# Altium project UHAL_MICRO_SD_BREAKOUT.PrjPcb
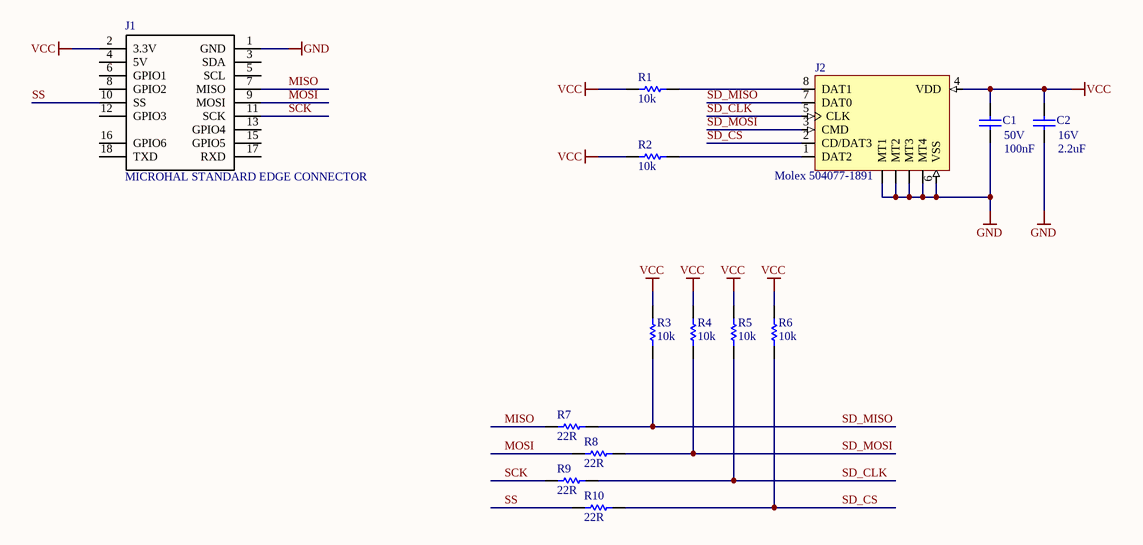
[diagram p0: micro_sd.SchDoc]
1 sheet, 14 parts. Net scope: global (net labels, ports and power ports of the same name join across sheets).

## Sheet micro_sd.SchDoc
size A4

### Parts
C1  Capacitance: 100nF  Voltage Rating (DC): 50V  [CAPC1608X90X35ML10T15]  (hidden comment: Murata GCM188R71H104KA57D)
C2  Capacitance: 2.2uF  Voltage Rating (DC): 16V  [CAPC2013X140X50ML20T25]  (hidden comment: Kemet C0805C225K4RACAUTO)
J1  MICROHAL STANDARD EDGE CONNECTOR  [PCB-n61ghpg3sznbl2uw6fwj-1]
J2  Molex 504077-1891  [PCB-4vacospa3sytmw4kcnv2-1]
R1  Resistance: 10k  [PCB-4hicoez4nmrdgyuwelf4-1]  (hidden comment: Res1)
R2  Resistance: 10k  [PCB-4hicoez4nmrdgyuwelf4-1]  (hidden comment: Res1)
R3  Resistance: 10k  [PCB-4hicoez4nmrdgyuwelf4-1]  (hidden comment: Res1)
R4  Resistance: 10k  [PCB-4hicoez4nmrdgyuwelf4-1]  (hidden comment: Res1)
R5  Resistance: 10k  [PCB-4hicoez4nmrdgyuwelf4-1]  (hidden comment: Res1)
R6  Resistance: 10k  [PCB-4hicoez4nmrdgyuwelf4-1]  (hidden comment: Res1)
R7  Resistance: 22R  [RESC1609X50X30ML10T20]  (hidden comment: Vishay Dale CRCW060322R0JNEA)
R8  Resistance: 22R  [RESC1609X50X30ML10T20]  (hidden comment: Vishay Dale CRCW060322R0JNEA)
R9  Resistance: 22R  [RESC1609X50X30ML10T20]  (hidden comment: Vishay Dale CRCW060322R0JNEA)
R10  Resistance: 22R  [RESC1609X50X30ML10T20]  (hidden comment: Vishay Dale CRCW060322R0JNEA)

### Nets
GND: C1.1 C2.2 J1.1(GND) J2.6(VSS) J2.MT1 J2.MT2 J2.MT3 J2.MT4
VCC: C1.2 C2.1 J1.2(3.3V) J2.4(VDD) R1.2 R2.2 R3.2 R4.2 R5.2 R6.2
MISO: J1.7(MISO) R7.2
MOSI: J1.9(MOSI) R8.2
SCK: J1.11(SCK) R9.2
SD_CLK: J2.5(CLK) R5.1 R9.1
SD_CS: J2.2(CD/DAT3) R6.1 R10.1
SD_MISO: J2.7(DAT0) R3.1 R7.1
SD_MOSI: J2.3(CMD) R4.1 R8.1
SS: J1.10(SS) R10.2
NetJ2_1: J2.1(DAT2) R2.1
NetJ2_8: J2.8(DAT1) R1.1

Not connected (* = marked no-connect by the designer): J1 3(SDA) 4(5V) 5(SCL) 6(GPIO1) 8(GPIO2) 12(GPIO3) 13(GPIO4) 15(GPIO5) 16(GPIO6) 17(RXD) 18(TXD)

### Library data of the parts
C1 = CMP-119667-3: CAP CER 0.1UF 50V 10% X7R 0603; Lead-Free Status: Lead Free; Capacitance Tolerance: ±10%; Dielectric Characteristic: X7R; Octopart Url: https://octopart.com/gcm188r71h104ka57d-murata-7894792; OctopartID: 3480fdf266eeeb47; Packaging: Cut Tape (CT); REACH SVHC Compliance: No SVHC; RoHS: Compliant
C2 = CMP-3913345-2: CAPACITOR, 0805, X7R, 16V, 2.2UF; Capacitance Tolerance: ±10%; Dielectric Material: Ceramic; Lead-Free Status: R; Case/Package: 0805; Dielectric Characteristic: X7R; Mounting Style: Surface Mount; Octopart Url: https://octopart.com/c0805c225k4racauto-kemet-22677353; OctopartID: 62f8aaa840f7bd3f; Packaging: Cut Tape (CT); REACH SVHC Compliance: No SVHC; RoHS: Compliant
J1 = CMP-6a3uyflm72uf0am1b36s-2: microhal standard edge connector with 17 pins
J2 = CMP-95805dba04df4a47-7: Conn Micro SD Card SKT 8 POS 1.1mm Solder RA SMD Embossed T/R 0.5A/Contact; Octopart URL: http://octopart.com/0472192001-molex-19969081; Manufacturer: Molex
R1-R6 = CMP-51de9888c13e8e19-9: Resistor; Thick Film; Res 10 Kilohms; Pwr-Rtg 0.1 W; Tol 1%; SMT; 0603; Packaging: Tape & Reel (TR); OctopartID: 51de9888c13e8e19; Octopart URL: http://octopart.com/cr0603-fx-1002hlf-bourns-6075782; REACH SVHC Compliance: No SVHC; RoHS: Compliant
R7-R10 = CMP-1856016-2: RES SMD 22 OHM 5% 1/10W 0603; Lead-Free Status: Lead Free; Power Rating: 0.1 W; Temperature Coefficient: 200.0 ppm/°C; Voltage Rating (DC): 75.0 V; Case/Package: 0603; Mounting Style: Surface Mount; Number of Pins: 2; Octopart Url: https://octopart.com/crcw060322r0jnea-vishay-39811628; OctopartID: 4df186a412bb9236; REACH SVHC Compliance: No SVHC; Resistance Tolerance: ±5%; RoHS: Compliant; Size-Height: 0.00045 m; Size-Length: 0.00155 m; Size-Width: 0.00085 m